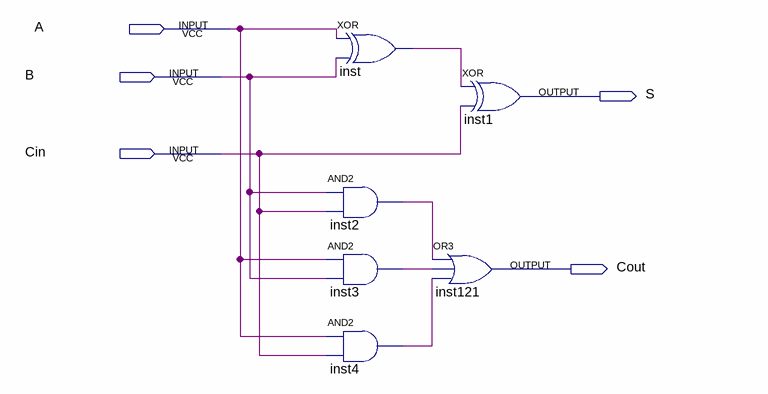
[diagram p0: schematic sheet]
// Quartus schematic FA.bdf as structural Verilog: 6 symbols, 5 pins
module FA (
  input  A,
  input  B,
  input  Cin,
  output S,
  output Cout
);

  wire inst2_out, inst3_out, inst4_out, inst_out;

  and inst2 (inst2_out, B, Cin);
  and inst3 (inst3_out, A, B);
  and inst4 (inst4_out, A, Cin);
  xor inst (inst_out, A, B);
  xor inst1 (S, inst_out, Cin);
  or inst121 (Cout, inst2_out, inst3_out, inst4_out);
endmodule
